# Altium schematic sheet obc-v2_CM4-IRQ-CTRL.SchDoc
size 420 x 297 mm; SheetNumber: 18; SheetTotal: 23
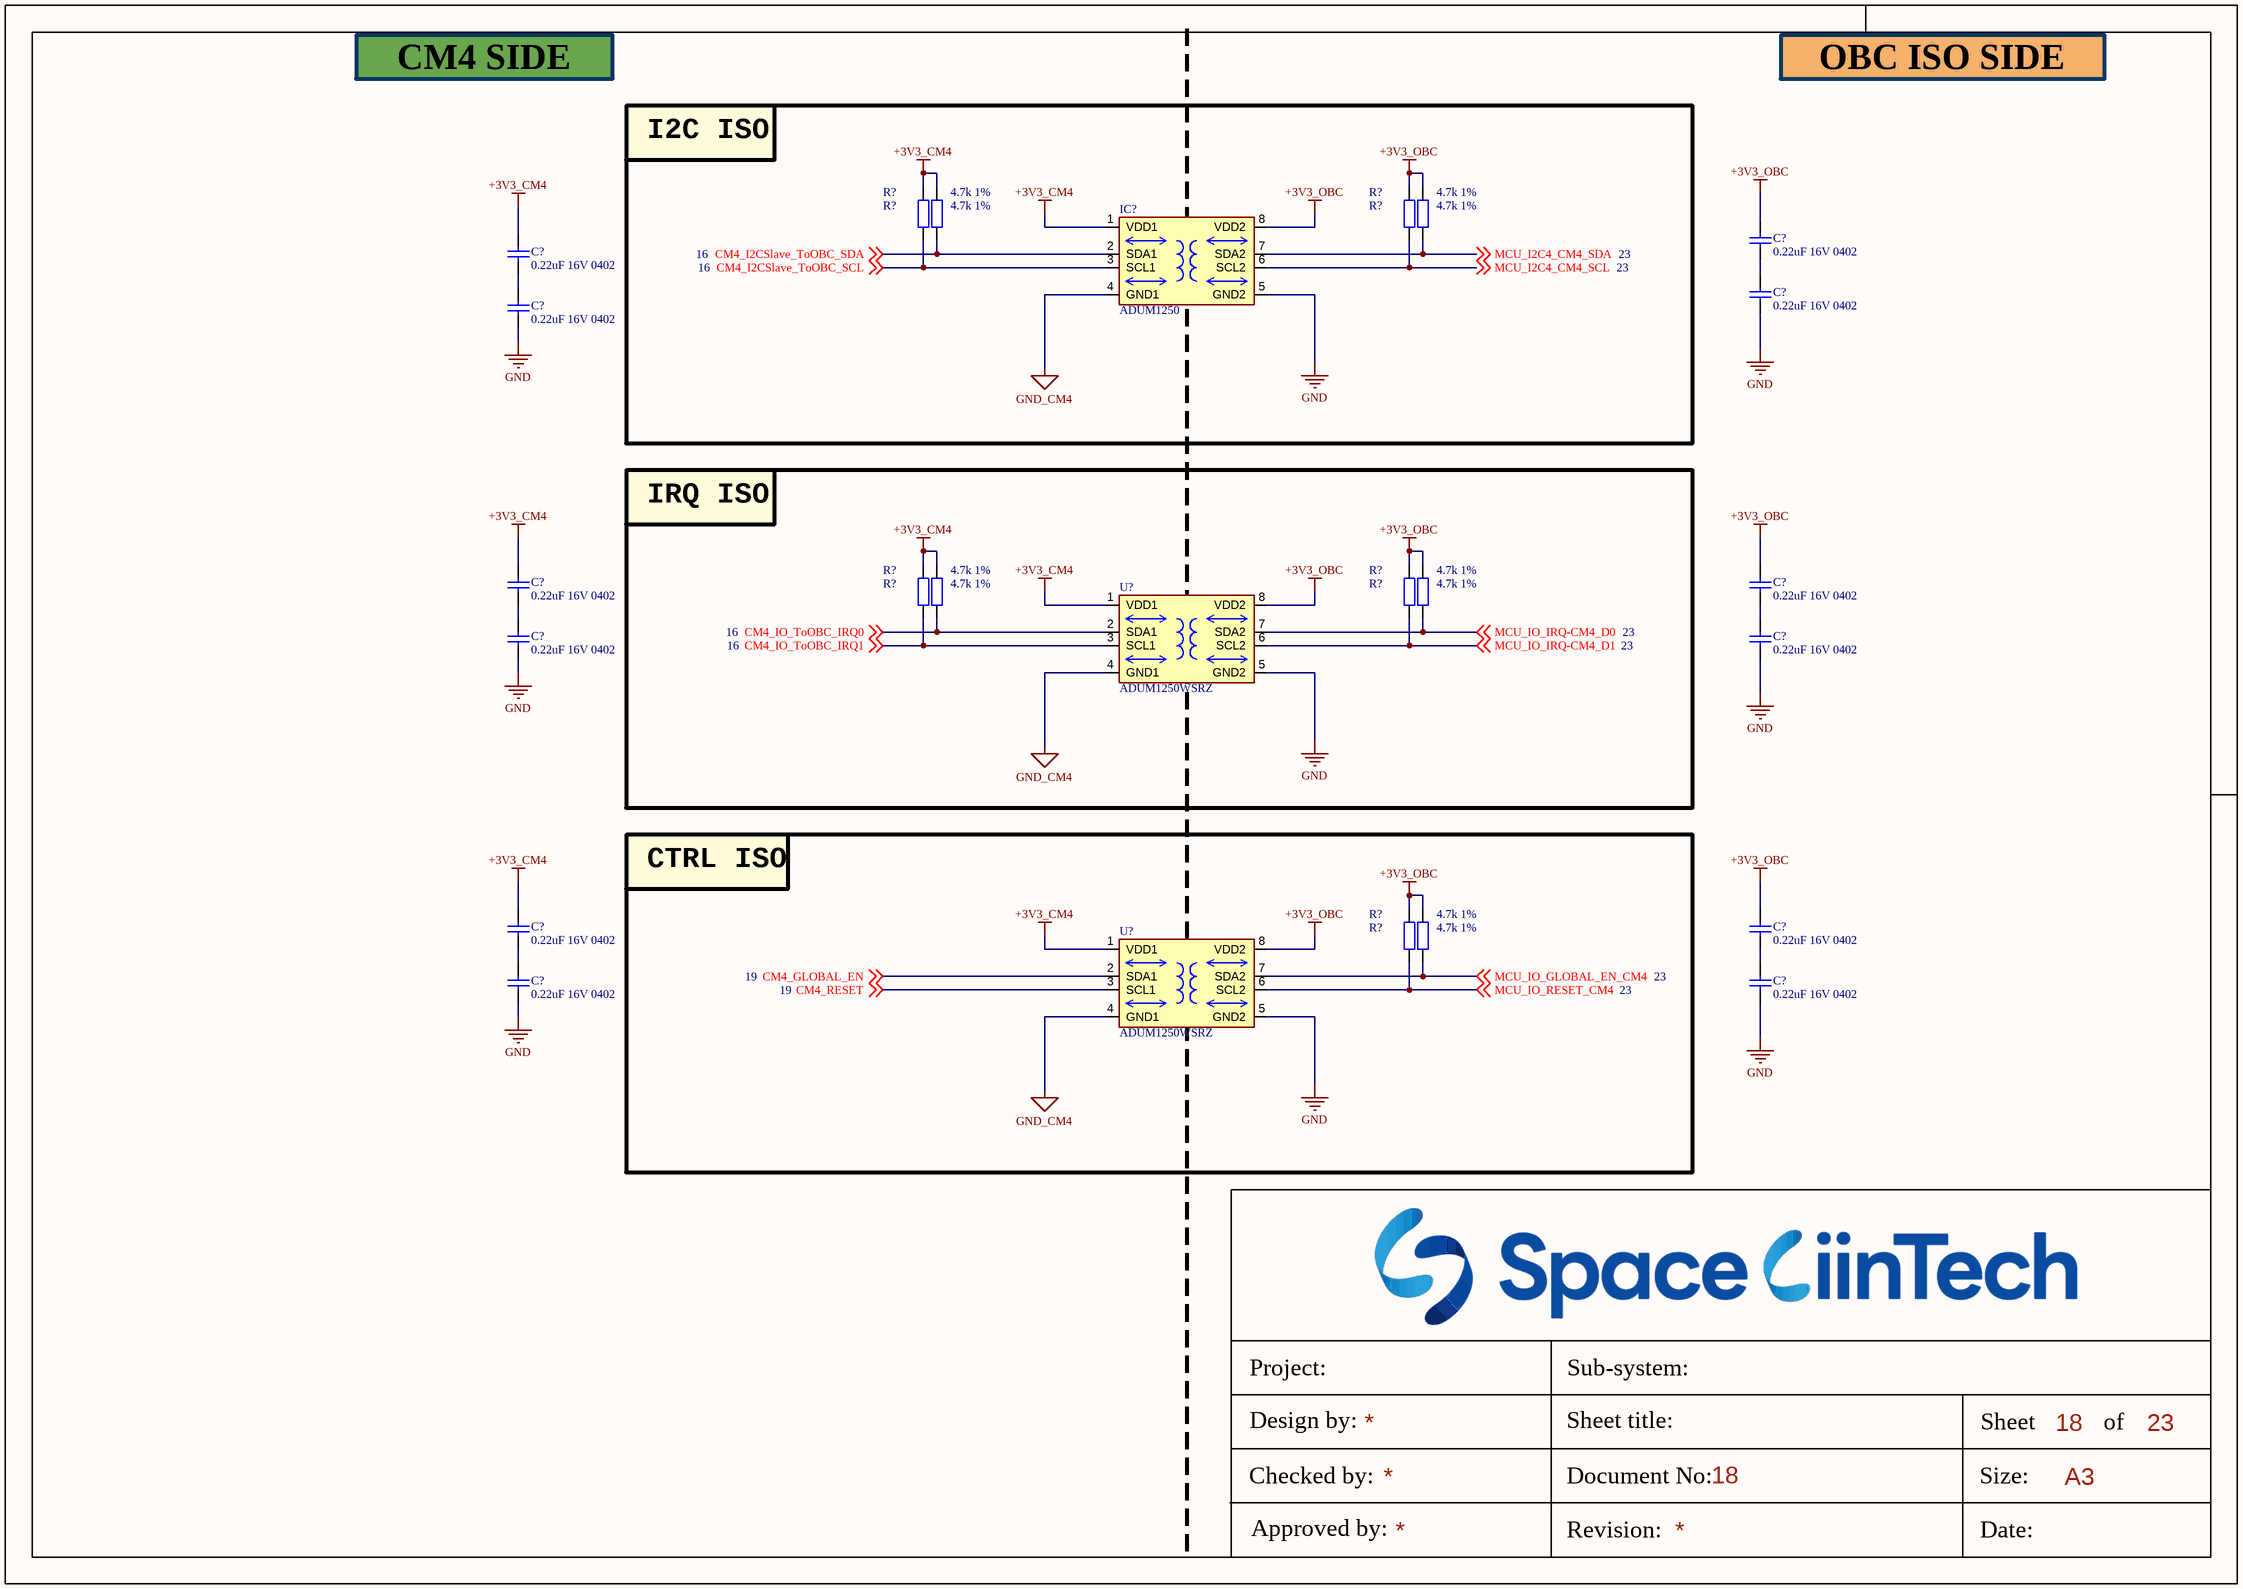
[diagram p0: obc-v2_CM4-IRQ-CTRL.SchDoc]

## Parts
(Parts that share a designator on the sheet are numbered #1, #2 ... from top to bottom, then left to right.)
C?#1  0.22uF 16V 0402  [tu 0402]
C?#2  0.22uF 16V 0402  [tu 0402]
C?#3  0.22uF 16V 0402  [tu 0402]
C?#4  0.22uF 16V 0402  [tu 0402]
C?#5  0.22uF 16V 0402  [tu 0402]
C?#6  0.22uF 16V 0402  [tu 0402]
C?#7  0.22uF 16V 0402  [tu 0402]
C?#8  0.22uF 16V 0402  [tu 0402]
C?#9  0.22uF 16V 0402  [tu 0402]
C?#10  0.22uF 16V 0402  [tu 0402]
C?#11  0.22uF 16V 0402  [tu 0402]
C?#12  0.22uF 16V 0402  [tu 0402]
IC?  ADUM1250  [SO8-COOL]
R?#1  4.7k 1%  [tro smd 0603]
R?#2  4.7k 1%  [tro smd 0603]
R?#3  4.7k 1%  [tro smd 0603]
R?#4  4.7k 1%  [tro smd 0603]
R?#5  4.7k 1%  [tro smd 0603]
R?#6  4.7k 1%  [tro smd 0603]
R?#7  4.7k 1%  [tro smd 0603]
R?#8  4.7k 1%  [tro smd 0603]
R?#9  4.7k 1%  [tro smd 0603]
R?#10  4.7k 1%  [tro smd 0603]
U?#1  ADUM1250WSRZ  [SO8-COOL]
U?#2  ADUM1250WSRZ  [SO8-COOL]

## Blocks framed on the sheet
I2C ISO: IC? R?#1-R?#4
IRQ ISO: R?#5-R?#8 U?#1
CTRL ISO: R?#9 R?#10 U?#2

## Nets
+3V3_CM4: C?#2.1 C?#5.1 C?#9.1 IC?.1(VDD1) R?#1.2 R?#2.2 R?#5.2 R?#6.2 U?#1.1(VDD1) U?#2.1(VDD1)
+3V3_OBC: C?#1.1 C?#6.1 C?#10.1 IC?.8(VDD2) R?#3.2 R?#4.2 R?#7.2 R?#8.2 R?#9.2 R?#10.2 U?#1.8(VDD2) U?#2.8(VDD2)
GND: C?#3.2 C?#4.2 C?#7.2 C?#8.2 C?#11.2 C?#12.2 IC?.5(GND2) U?#1.5(GND2) U?#2.5(GND2)
GND_CM4: IC?.4(GND1) U?#1.4(GND1) U?#2.4(GND1)
CM4_GLOBAL_EN: U?#2.2(SDA1) ; off-sheet CM4_GLOBAL_EN
CM4_I2CSlave_ToOBC_SCL: IC?.3(SCL1) R?#1.1 ; off-sheet CM4_I2CSlave_ToOBC_SCL
CM4_I2CSlave_ToOBC_SDA: IC?.2(SDA1) R?#2.1 ; off-sheet CM4_I2CSlave_ToOBC_SDA
CM4_IO_ToOBC_IRQ0: R?#6.1 U?#1.2(SDA1) ; off-sheet CM4_IO_ToOBC_IRQ0
CM4_IO_ToOBC_IRQ1: R?#5.1 U?#1.3(SCL1) ; off-sheet CM4_IO_ToOBC_IRQ1
CM4_RESET: U?#2.3(SCL1) ; off-sheet CM4_RESET
MCU_I2C4_CM4_SCL: IC?.6(SCL2) R?#3.1 ; off-sheet MCU_I2C4_CM4_SCL
MCU_I2C4_CM4_SDA: IC?.7(SDA2) R?#4.1 ; off-sheet MCU_I2C4_CM4_SDA
MCU_IO_GLOBAL_EN_CM4: R?#10.1 U?#2.7(SDA2) ; off-sheet MCU_IO_GLOBAL_EN_CM4
MCU_IO_IRQ-CM4_D0: R?#8.1 U?#1.7(SDA2) ; off-sheet MCU_IO_IRQ-CM4_D0
MCU_IO_IRQ-CM4_D1: R?#7.1 U?#1.6(SCL2) ; off-sheet MCU_IO_IRQ-CM4_D1
MCU_IO_RESET_CM4: R?#9.1 U?#2.6(SCL2) ; off-sheet MCU_IO_RESET_CM4
NetC?#1_2: C?#1.2 C?#3.1
NetC?#2_2: C?#2.2 C?#4.1
NetC?#5_2: C?#5.2 C?#7.1
NetC?#6_2: C?#6.2 C?#8.1
NetC?#9_2: C?#9.2 C?#11.1
NetC?#10_2: C?#10.2 C?#12.1

## Notes on the sheet
- CM4 SIDE
- OBC ISO SIDE
- Project:
- Sub-system:
- Design by:
- Sheet title:
- Sheet
- A3
- of
- Checked by:
- Approved by:
- Revision:
- Document No:
- Size:
- Date:

## Library data of the parts
C?#1-C?#12 = Tu 0402 33nF 10V: 0.22 µF ±10% 16V Ceramic Capacitor X7R 0402 (1005 Metric): GCM155R71C224KE02D; Chung_Loai: Dán; Don_Vi: Con; So_Chan: 2; Ten_Linh_Kien: Tụ 0402 33nF X7R 10V GRM155R71A333KA01D; Ma_Hang: MH007853; Kieu_Chan: *
IC? U?#1 U?#2 = ADUM1250: IÂ²C Digital Isolator 2500Vrms 2 Channel 1Mbps 25kV/Âµs CMTI 8-SOIC (0.154", 3.90mm Width); MF: Analog Devices; Package: SOIC-8; Price: None; Value: *; SnapEDA_Link: https://www.snapeda.com/parts/ADUM1250/Analog+Devices/view-part/?ref=snap; MP: ADUM1250; Availability: Unavailable; Check_prices: https://www.snapeda.com/parts/ADUM1250/Analog+Devices/view-part/?ref=eda
R?#1-R?#10 = Tro 0603 1% 10k: RES 4.7K OHM 1% 1/10W 0603, P/N: ERJ-U03F4701V; Chung_Loai: Dán; Don_Vi: Con; So_Chan: 2; Ten_Linh_Kien: Trở 0603 1% 10k; Ma_Hang: MH006333; Kieu_Chan: *